# EAGLE design PRoMo_Base_CMS (EAGLE 7.2.0)
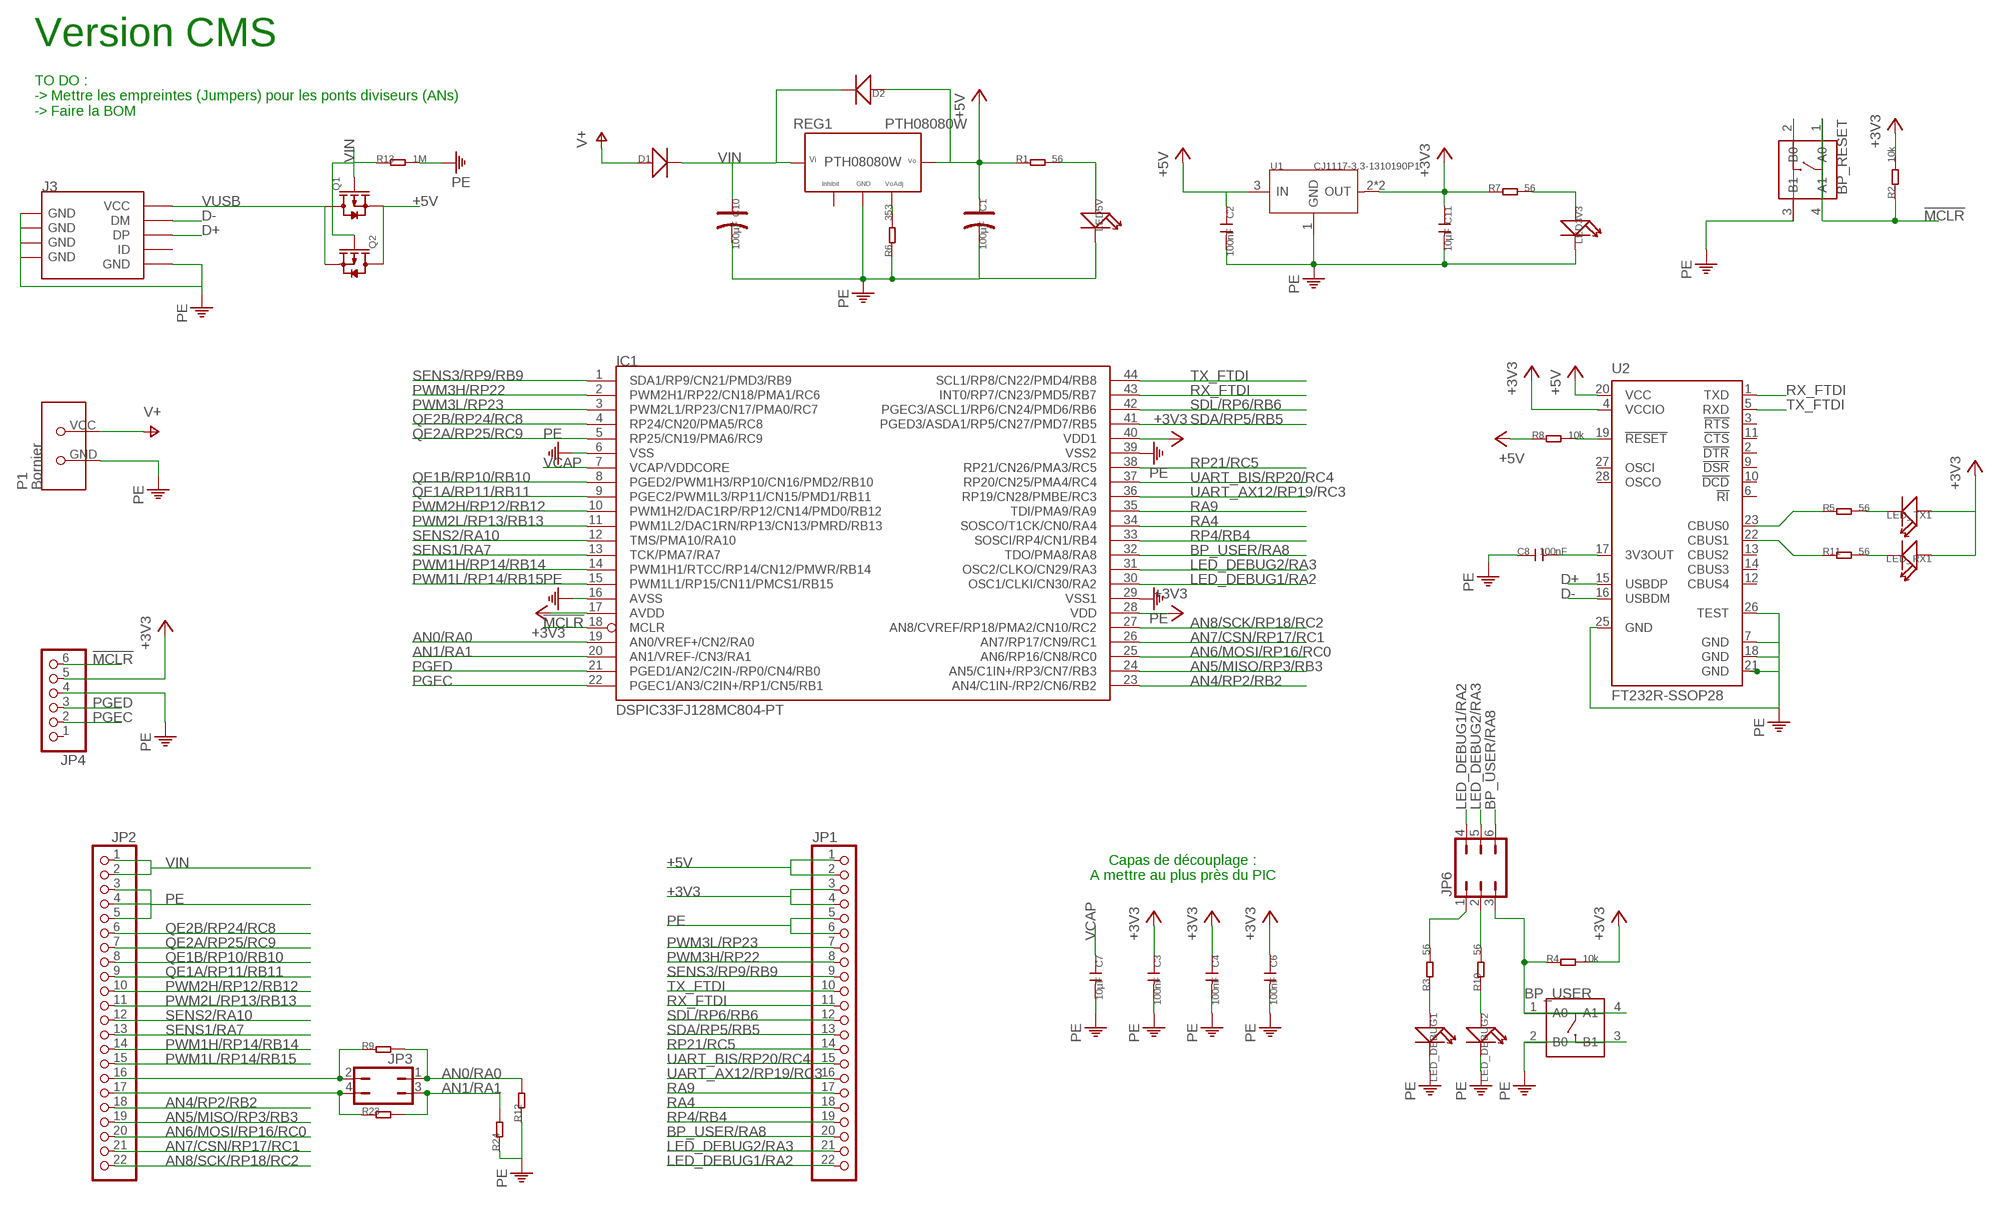
[diagram p0: schematic, sheet 1]

## Parts
BP_RESET  BUTTON-4P-6.2X6.2  [4P-6.2X6.2]
BP_USER  BUTTON-4P-6.2X6.2  [4P-6.2X6.2]
C1  100µF  CAP-D5.3/2.0  [ELECTRO-5.3MM]
C2  100nF  C-0805  [C0805]
C3  100nF  C-0805  [C0805]
C4  100nF  C-0805  [C0805]
C6  100nF  C-0805  [C0805]
C7  10µF  C-0805  [C0805]
C8  100nF  C-0805  [C0805]
C10  100µF  CAP-D5.3/2.0  [ELECTRO-5.3MM]
C11  10µF  C-0805  [C0805]
D1  D'1206'  [SOD123]
D2  D'1206'  [SOD123]
IC1  DSPIC33FJ128MC804-PT  [TQFP44]
J3  USB-MINIUSB-5P-TH  [MINI-5P]
JP1  PINHD-1X22  [1X22]
JP2  PINHD-1X22  [1X22]
JP3  JP2Q  [JP2Q]
JP4  PINHD-1X6/90  [1X06/90]
JP6  JP3Q  [JP3Q]
LED3V3  LED'1206'  [LED-1206]
LED5V  LED'1206'  [LED-1206]
LED_DEBUG1  LED'1206'  [LED-1206]
LED_DEBUG2  LED'1206'  [LED-1206]
LED_RX1  LED'1206'  [LED-1206]
LED_TX1  LED'1206'  [LED-1206]
P1  Bornier  BORNIER_3.5MM  [BORNIER_COUDEE_3.5]
Q1  MOSFET-P'SI2323CDS/SI2305DS<BR>'  [SOT23]
Q2  MOSFET-P'SI2323CDS/SI2305DS<BR>'  [SOT23]
R1  56  R-0805  [R0805]
R2  10k  R-0805  [R0805]
R3  56  R-0805  [R0805]
R4  10k  R-0805  [R0805]
R5  56  R-0805  [R0805]
R6  353  R-0204/7  [R0204/7]
R7  56  R-0805  [R0805]
R8  10k  R-0805  [R0805]
R9  R-0805  [R0805]
R10  56  R-0805  [R0805]
R11  56  R-0805  [R0805]
R12  R-0805  [R0805]
R13  1M  R-0805  [R0805]
R23  R-0805  [R0805]
R24  R-0805  [R0805]
REG1  PTH08080W  [PTH08080W]
U1  CJ1117-3.3-1310190P1  [SOT223]
U2  FT232R-SSOP28  [SSOP28]

## Nets
!MCLR!: BP_RESET.1(A0) BP_RESET.4(A1) IC1.18(MCLR) JP4.6 R2.1
+3V3: C3.1 C4.1 C6.1 C11.1 IC1.17(AVDD) IC1.28(VDD) IC1.40(VDD1) JP1.3 JP1.4 JP4.5 LED_RX1.+ LED_TX1.+ R2.2 R4.2 R7.1 U1.2(OUT) U1.TER(OUT) U2.4(VCCIO)
+5V: C1.+ C2.1 D2.+ JP1.1 JP1.2 Q1.2(S) Q2.3(D) R1.1 R8.1 REG1.P$3(3_VO) U1.3(IN) U2.20(VCC)
AN0/RA0: IC1.19(AN0/VREF+/CN2/RA0) JP3.1 R9.2 R12.2
AN1/RA1: IC1.20(AN1/VREF-/CN3/RA1) JP3.3 R23.2 R24.2
AN4/RP2/RB2: IC1.23(AN4/C1IN-/RP2/CN6/RB2) JP2.18
AN5/MISO/RP3/RB3: IC1.24(AN5/C1IN+/RP3/CN7/RB3) JP2.19
AN6/MOSI/RP16/RC0: IC1.25(AN6/RP16/CN8/RC0) JP2.20
AN7/CSN/RP17/RC1: IC1.26(AN7/RP17/CN9/RC1) JP2.21
AN8/SCK/RP18/RC2: IC1.27(AN8/CVREF/RP18/PMA2/CN10/RC2) JP2.22
BP: BP_USER.1(A0) BP_USER.4(A1) JP6.3 R4.1
BP_USER/RA8: IC1.32(TDO/PMA8/RA8) JP1.20 JP6.6
D+: J3.DP U2.15(USBDP)
D-: J3.DM U2.16(USBDM)
LED_DEBUG1/RA2: IC1.30(OSC1/CLKI/CN30/RA2) JP1.22 JP6.4
LED_DEBUG2/RA3: IC1.31(OSC2/CLKO/CN29/RA3) JP1.21 JP6.5
N$2: R6.2 REG1.P$4(4_VOADJ)
N$3: LED5V.+ R1.2
N$5: LED_DEBUG1.+ R3.1
N$6: JP6.1 R3.2
N$7: LED3V3.+ R7.2
N$8: C8.2 U2.17(3V3OUT)
N$9: R8.2 U2.19(!RESET)
N$10: JP2.17 JP3.4 R23.1
N$11: JP2.16 JP3.2 R9.1
N$12: R11.1 U2.22(CBUS1)
N$13: R5.1 U2.23(CBUS0)
N$14: LED_DEBUG2.+ R10.1
N$15: LED_TX1.- R5.2
N$16: JP6.2 R10.2
N$17: LED_RX1.- R11.2
PE: BP_RESET.2(B0) BP_RESET.3(B1) BP_USER.2(B0) BP_USER.3(B1) C1.- C2.2 C3.2 C4.2 C6.2 C7.2 C8.1 C10.- C11.2 IC1.6(VSS) IC1.16(AVSS) IC1.29(VSS1) IC1.39(VSS2) J3.GND J3.S1(GND) J3.S2(GND) J3.S3(GND) J3.S4(GND) JP1.5 JP1.6 JP2.3 JP2.4 JP2.5 JP4.4 LED3V3.- LED5V.- LED_DEBUG1.- LED_DEBUG2.- P1.GND R6.1 R12.1 R13.2 R24.1 REG1.P$2(2_GND) U1.1(GND) U2.7(GND) U2.18(GND) U2.21(GND) U2.25(GND) U2.26(TEST)
PGEC: IC1.22(PGEC1/AN3/C2IN+/RP1/CN5/RB1) JP4.2
PGED: IC1.21(PGED1/AN2/C2IN-/RP0/CN4/RB0) JP4.3
PWM1H/RP14/RB14: IC1.14(PWM1H1/RTCC/RP14/CN12/PMWR/RB14) JP2.14
PWM1L/RP14/RB15: IC1.15(PWM1L1/RP15/CN11/PMCS1/RB15) JP2.15
PWM2H/RP12/RB12: IC1.10(PWM1H2/DAC1RP/RP12/CN14/PMD0/RB12) JP2.10
PWM2L/RP13/RB13: IC1.11(PWM1L2/DAC1RN/RP13/CN13/PMRD/RB13) JP2.11
PWM3H/RP22: IC1.2(PWM2H1/RP22/CN18/PMA1/RC6) JP1.8
PWM3L/RP23: IC1.3(PWM2L1/RP23/CN17/PMA0/RC7) JP1.7
QE1A/RP11/RB11: IC1.9(PGEC2/PWM1L3/RP11/CN15/PMD1/RB11) JP2.9
QE1B/RP10/RB10: IC1.8(PGED2/PWM1H3/RP10/CN16/PMD2/RB10) JP2.8
QE2A/RP25/RC9: IC1.5(RP25/CN19/PMA6/RC9) JP2.7
QE2B/RP24/RC8: IC1.4(RP24/CN20/PMA5/RC8) JP2.6
RA4: IC1.34(SOSCO/T1CK/CN0/RA4) JP1.18
RA9: IC1.35(TDI/PMA9/RA9) JP1.17
RP4/RB4: IC1.33(SOSCI/RP4/CN1/RB4) JP1.19
RP21/RC5: IC1.38(RP21/CN26/PMA3/RC5) JP1.14
RX_FTDI: IC1.43(INT0/RP7/CN23/PMD5/RB7) JP1.11 U2.1(TXD)
SDA/RP5/RB5: IC1.41(PGED3/ASDA1/RP5/CN27/PMD7/RB5) JP1.13
SDL/RP6/RB6: IC1.42(PGEC3/ASCL1/RP6/CN24/PMD6/RB6) JP1.12
SENS1/RA7: IC1.13(TCK/PMA7/RA7) JP2.13
SENS2/RA10: IC1.12(TMS/PMA10/RA10) JP2.12
SENS3/RP9/RB9: IC1.1(SDA1/RP9/CN21/PMD3/RB9) JP1.9
TX_FTDI: IC1.44(SCL1/RP8/CN22/PMD4/RB8) JP1.10 U2.5(RXD)
UART_AX12/RP19/RC3: IC1.36(RP19/CN28/PMBE/RC3) JP1.16
UART_BIS/RP20/RC4: IC1.37(RP20/CN25/PMA4/RC4) JP1.15
V+: D1.+ P1.VCC
VCAP: C7.1 IC1.7(VCAP/VDDCORE)
VIN: C10.+ D1.- D2.- JP2.1 JP2.2 Q1.1(G) Q2.1(G) R13.1 REG1.P$1(1_VI)
VUSB: J3.VCC Q1.3(D) Q2.2(S)
Unconnected: J3.ID JP4.1 REG1.P$5(5_INHIBIT) U2.2(!DTR) U2.3(!RTS) U2.6(!RI) U2.9(!DSR) U2.10(!DCD) U2.11(!CTS) U2.12(CBUS4) U2.13(CBUS2) U2.14(CBUS3) U2.27(OSCI) U2.28(OSCO)

## Notes on the sheet
- Version CMS
- TO DO : 
  -> Mettre les empreintes (Jumpers) pour les ponts diviseurs (ANs)
  -> Faire la BOM
- Capas de découplage :
  A mettre au plus près du PIC

## Library data of the parts
BP_RESET BP_USER = Discrete:BUTTON-4P
C1 C10 = Discrete:CAP*: Electrolytic Capacitors,Tantalum Capacitors and Super Capacitors
C2-C4 C6-C8 C11 = Discrete:C*: Ceramic Capacitors
D1 D2 = Discrete:D*
IC1 = microchip-dspic33fjxxmc:DSPIC33FJ128MC804: dsPIC33FJ32MC302/304, dsPIC33FJ64MCX02/X04, AND dsPIC33FJ128MCX02/X04 High-Performance, 16-bit Digital Signal Controllers Package:44 Pin TQFP Operating Range: * Up to 40 MIPS operation (at 3.0V -3.6V): - Industrial temperature range (-40°C to +85°C) - Extended temperature range (-40°C to +125°C) High-Performance DSC CPU: * Modified Harvard architecture * C compiler optimized instruction set * 16-bit wide data path * 24-bit wide instructions * Linear program memory addressing up to 4M instruction words * Linear data memory addressing up to 64 Kbytes * 83 base instructions: mostly 1 word/1 cycle * Two 40-bit accumulators with rounding and saturation options * Flexible and powerful addressing modes: - Indirect - Modulo - Bit-Reversed * Software stack * 16 x 16 fractional/integer multiply operations * 32/16 and 16/16 divide operations * Single-cycle multiply and accumulate: - Accumulator write back for DSP operations - Dual data fetch * Up to ±16-bit shifts for up to 40-bit data Direct Memory Access (DMA): * 8-channel hardware DMA * Up to 2 Kbytes dual ported DMA buffer area (DMA RAM) to store data transferred via DMA: - Allows data transfer between RAM and a peripheral while CPU is executing code (no cycle stealing) * Most peripherals support DMA Timers/Capture/Compare/PWM: * Timer/Counters, up to five 16-bit timers: - Can pair up to make two 32-bit timers - One timer runs as a Real-Time Clock with an external 32.768 kHz oscillator - Programmable prescaler * Input Capture (up to four channels): - Capture on up, down or both edges - 16-bit capture input functions - 4-deep FIFO on each capture * Output Compare (up to four channels): - Single or Dual 16-bit Compare mode - 16-bit Glitchless PWM mode * Hardware Real-Time Clock/Calendar (RTCC): - Provides clock, calendar, and alarm functions Interrupt Controller: * 5-cycle latency * Up to 53 available interrupt sources * Up to three external interrupts * Seven programmable priority levels * Five processor exceptions Digital I/O: * Peripheral pin Select functionality * Up to 35 programmable digital I/O pins * Wake-up/Interrupt-on-Change for up to 31 pins * Output pins can drive from 3.0V to 3.6V * Up to 5V output with open drain configuration * All digital input pins are 5V tolerant * 4 mA sink on all I/O pins On-Chip Flash and SRAM: * Flash program memory (up to 128 Kbytes) * Data SRAM (up to 16 Kbytes) * Boot, Secure, and General Security for program Flash System Management: * Flexible clock options: - External, crystal, resonator, internal RC - Fully integrated Phase-Locked Loop (PLL) - Extremely low jitter PLL * Power-up Timer * Oscillator Start-up Timer/Stabilizer * Watchdog Timer with its own RC oscillator * Fail-Safe Clock Monitor * Reset by multiple sources Power Management: * On-chip 2.5V voltage regulator * Switch between clock sources in real time * Idle, Sleep, and Doze modes with fast wake-up Analog-to-Digital Converters (ADCs): * 10-bit, 1.1 Msps or 12-bit, 500 Ksps conversion: - Two and four simultaneous samples (10-bit ADC) - Up to nine input channels with auto-scanning - Conversion start can be manual or synchronized with one of four trigger sources - Conversion possible in Sleep mode - ±2 LSb max integral nonlinearity - ±1 LSb max differential nonlinearity Audio Digital-to-Analog Converter (DAC): - 16-bit Dual Channel DAC module - 100 Ksps maximum sampling rate - Second-Order Digital Delta-Sigma Modulator Comparator Module: * Two analog comparators with programmable input/output configuration CMOS Flash Technology: * Low-power, high-speed Flash technology * Fully static design * 3.3V (±10%) operating voltage * Industrial and Extended temperature * Low power consumption Motor Control Peripherals: * 6-channel 16-bit Motor Control PWM: - Three duty cycle generators - Independent or Complementary mode - Programmable dead-time and output polarity - Edge-aligned or center-aligned - Manual output override control - One Fault input - Trigger for ADC conversions - PWM frequency for 16-bit resolution (@ 40 MIPS) = 1220 Hz for Edge-Aligned mode, 610 Hz for Center-Aligned mode - PWM frequency for 11-bit resolution (@ 40 MIPS) = 39.1 kHz for Edge-Aligned mode, 19.55 kHz for Center-Aligned mode * 2-channel 16-bit Motor Control PWM: - One duty cycle generator - Independent or Complementary mode - Programmable dead time and output polarity - Edge-aligned or center-aligned - Manual output override control - One Fault input - Trigger for ADC conversions - PWM frequency for 16-bit resolution (@ 40 MIPS) = 1220 Hz for Edge-Aligned mode, 610 Hz for Center-Aligned mode - PWM frequency for 11-bit resolution (@ 40 MIPS) = 39.1 kHz for Edge-Aligned mode, 19.55 kHz for Center-Aligned mode * 2-Quadrature Encoder Interface module: - Phase A, Phase B, and index pulse input - 16-bit up/down position counter - Count direction status - Position Measurement (x2 and x4) mode - Programmable digital noise filters on inputs - Alternate 16-bit Timer/Counter mode - Interrupt on position counter rollover/underflow
J3 = Connector :USB-MINIUSB-5P
JP1 JP2 = pinhead:PINHD-1X22: PIN HEADER
JP3 = jumper:JP2Q: JUMPER
JP4 = pinhead:PINHD-1X6: PIN HEADER
JP6 = jumper:JP3Q: JUMPER
LED3V3 LED5V LED_DEBUG1 LED_DEBUG2 LED_RX1 LED_TX1 = Discrete:LED*
P1 = Perso:BORNIER_3.5MM: Bornier 3.5mm Bornier emfichable 3.5mm coudée
Q1 Q2 = Discrete:MOSFET-P
R1-R13 R23 R24 = Discrete:R*
REG1 = Perso:PTH08080W: TI Régulateur PTH08080W : Vin = [4.5 ; 18] V, Vout = [0.9 ; 5.5] V, Iout = 2.25 A.
U1 = OPL:CJ1117-3.3: 1A Low Dropout Linear Regulator
U2 = IC:FT232R: USB UART IC Source: http://www.ftdichip.com/Documents/DataSheets/DS_FT232R_v104.pdf

## Board
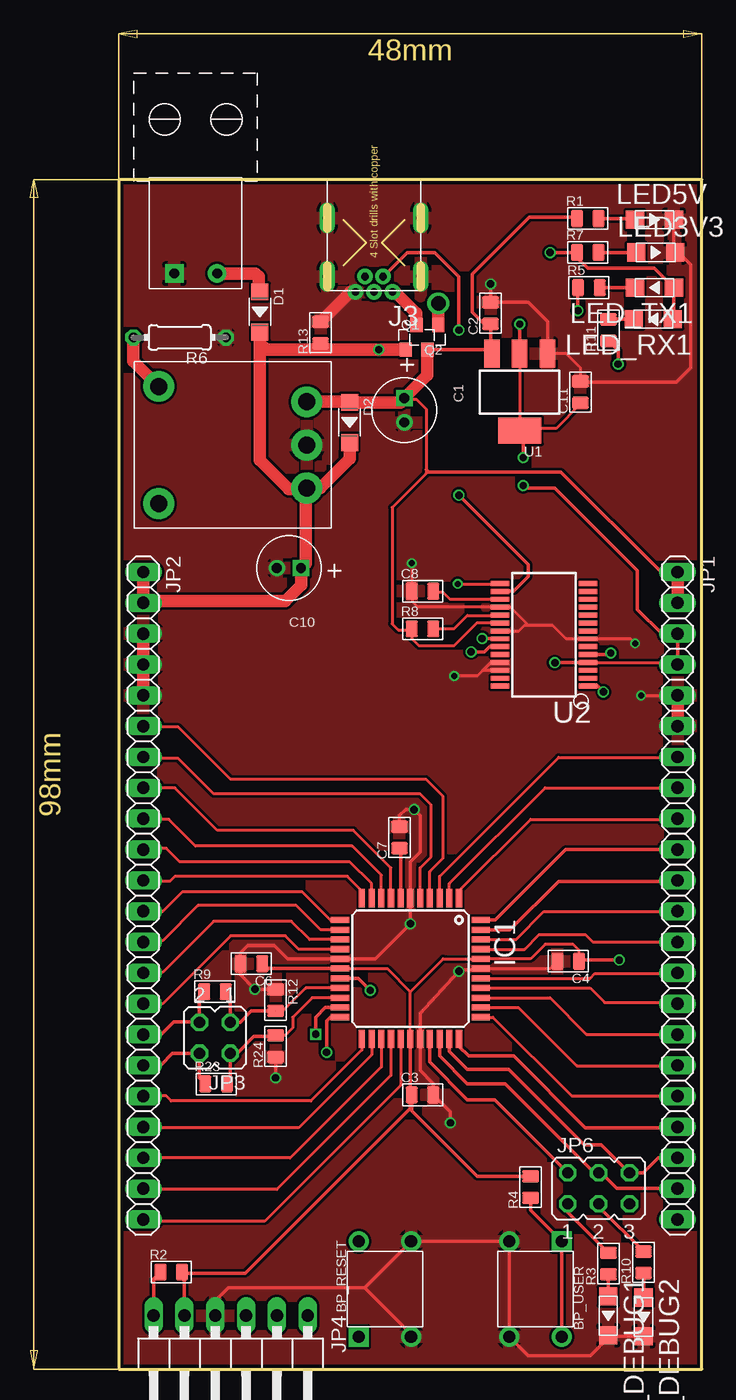
[diagram p1: board, top side]
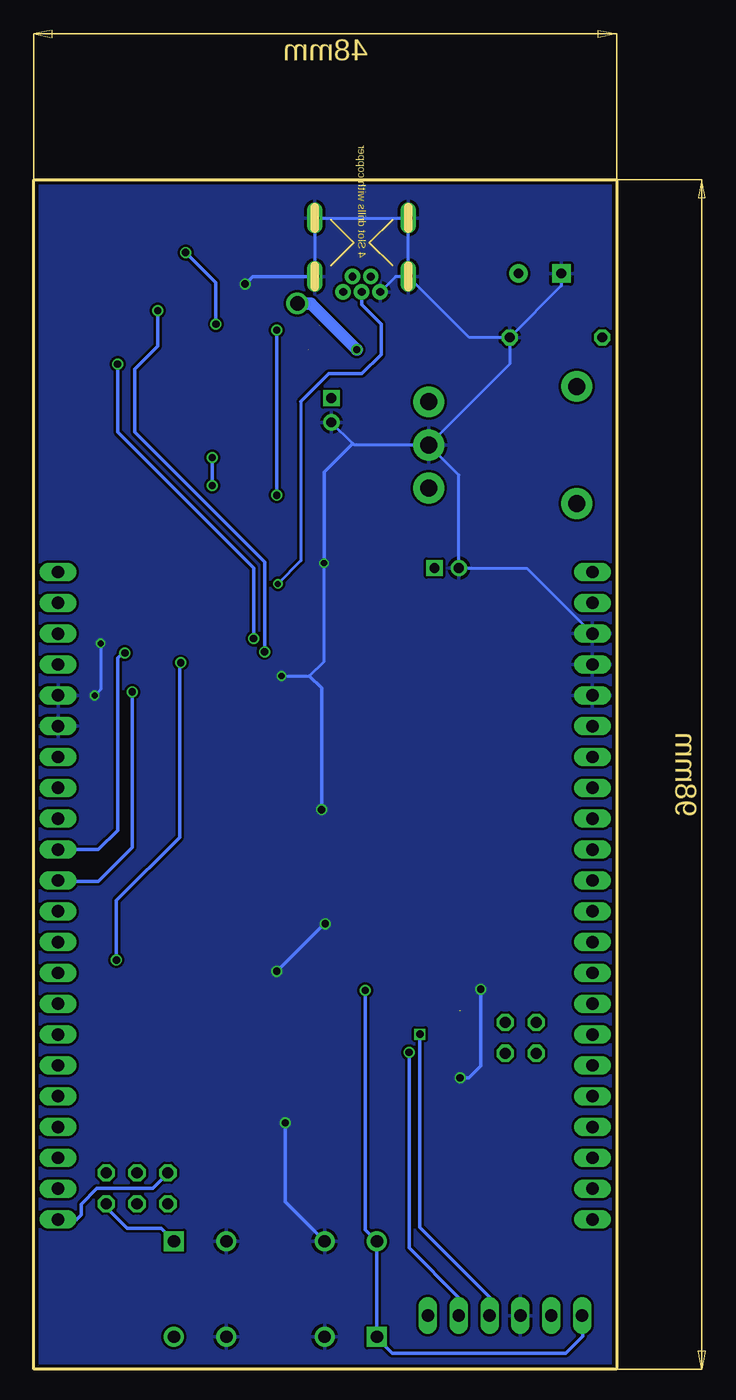
[diagram p2: board, bottom side, seen from below]

Size 48 x 98 mm. Coordinates in mm from the lower left corner, seen from the top.
Outline: 0,0 48,0 48,98 0,98 0,0
Copper layers (1*16): Top 0.035mm / dielectric 1.5mm / Bottom 0.035mm
Design rules "SeeedStudio_2layer_DRU_no_angle_20140221 *": minimum track width 6mil, minimum drill 12mil, track to track 8mil, track to pad 8mil, pad to pad 8mil, via to via 8mil, smd to smd 0mil, copper to edge 10mil, drill to drill 10mil, minimum pad ring 10mil, minimum via ring 6mil, stop-mask expansion 2mil, vias tented up to drill 100mil, thermal gap 10mil

### Footprints (pad centres in the part's own frame; a part is rotated, then mirrored left to right if it is on the bottom)
4P-6.2X6.2 = drill 1.016 pad 1.651 square: 1 -3.937,2.159 | drill 1.016 pad 1.651: 2 -3.937,-2.159; 3 3.937,-2.159; 4 3.937,2.159
ELECTRO-5.3MM = drill 0.8 pad 1.35 square: + -1,0 | drill 0.8 pad 1.35: - 1,0
C0805 = smd 1.016 x 1.397: 1 -0.889,0; 2 0.889,0
SOD123 = smd 1.397 x 1.397: + -1.651,0; - 1.651,0
TQFP44 = smd 1.5 x 0.5: 1 -5.8,4; 2 -5.8,3.2; 3 -5.8,2.4; 4 -5.8,1.6; 5 -5.8,0.8; 6 -5.8,0; 7 -5.8,-0.8; 8 -5.8,-1.6; 9 -5.8,-2.4; 10 -5.8,-3.2; 11 -5.8,-4; 23 5.8,-4; 24 5.8,-3.2; 25 5.8,-2.4; 26 5.8,-1.6; 27 5.8,-0.8; 28 5.8,0; 29 5.8,0.8; 30 5.8,1.6; 31 5.8,2.4; 32 5.8,3.2; 33 5.8,4 | smd 0.5 x 1.5: 12 -4,-5.8; 13 -3.2,-5.8; 14 -2.4,-5.8; 15 -1.6,-5.8; 16 -0.8,-5.8; 17 0,-5.8; 18 0.8,-5.8; 19 1.6,-5.8; 20 2.4,-5.8; 21 3.2,-5.8; 22 4,-5.8; 34 4,5.8; 35 3.2,5.8; 36 2.4,5.8; 37 1.6,5.8; 38 0.8,5.8; 39 0,5.8; 40 -0.8,5.8; 41 -1.6,5.8; 42 -2.4,5.8; 43 -3.2,5.8; 44 -4,5.8
MINI-5P = drill 0.635 pad 1.27: DM -1.016,0.75; DP 0.254,0; GND 0.254,-1.524; ID -1.016,-0.75; VCC 0.254,1.524 | drill 0.7 pad 1.27 long: S1 -5.842,3.85; S2 -1.016,3.85; S3 -5.842,-3.85; S4 -1.016,-3.85
1X22 = drill 1.016 long: 1 -26.67,0; 2 -24.13,0; 3 -21.59,0; 4 -19.05,0; 5 -16.51,0; 6 -13.97,0; 7 -11.43,0; 8 -8.89,0; 9 -6.35,0; 10 -3.81,0; 11 -1.27,0; 12 1.27,0; 13 3.81,0; 14 6.35,0; 15 8.89,0; 16 11.43,0; 17 13.97,0; 18 16.51,0; 19 19.05,0; 20 21.59,0; 21 24.13,0; 22 26.67,0
JP2Q = drill 0.914 octagon: 1 -1.27,-1.27; 2 1.27,-1.27; 3 -1.27,1.27; 4 1.27,1.27
1X06/90 = drill 1.016 long: 1 -6.35,-3.81; 2 -3.81,-3.81; 3 -1.27,-3.81; 4 1.27,-3.81; 5 3.81,-3.81; 6 6.35,-3.81
JP3Q = drill 0.914 octagon: 1 -2.54,-1.27; 2 0,-1.27; 3 2.54,-1.27; 4 -2.54,1.27; 5 0,1.27; 6 2.54,1.27
LED-1206 = smd 1.5 x 1.5: + -1.6,0; - 1.6,0
BORNIER_COUDEE_3.5 = drill 0.8 pad 1.524 square: GND 2.057,1.27 | drill 0.8 pad 1.524: VCC 5.588,1.27
SOT23 = smd 1.016 x 1.143: 1 -0.889,-1.016; 2 0.889,-1.016; 3 0,1.016
R0805 = smd 1.016 x 1.397: 1 -0.889,0; 2 0.889,0
R0204/7 = drill 0.813 octagon: 1 -3.81,0; 2 3.81,0
PTH08080W = drill 1.4 pad 2.54: P$1 2.032,10.414; P$2 2.032,6.858; P$3 2.032,3.302; P$4 14.224,2.032; P$5 14.224,11.684
SOT223 = smd 1.27 x 2.286: 1 -2.286,-3.175; 2 0,-3.175; 3 2.286,-3.175 | smd 3.556 x 2.159: TER 0,3.175
SSOP28 = smd 0.4 x 1.5: 1 -4.225,-3.625; 2 -3.575,-3.625; 3 -2.925,-3.625; 4 -2.275,-3.625; 5 -1.625,-3.625; 6 -0.975,-3.625; 7 -0.325,-3.625; 8 0.325,-3.625; 9 0.975,-3.625; 10 1.625,-3.625; 11 2.275,-3.625; 12 2.925,-3.625; 13 3.575,-3.625; 14 4.225,-3.625; 15 4.225,3.625; 16 3.575,3.625; 17 2.925,3.625; 18 2.275,3.625; 19 1.625,3.625; 20 0.975,3.625; 21 0.325,3.625; 22 -0.325,3.625; 23 -0.975,3.625; 24 -1.625,3.625; 25 -2.275,3.625; 26 -2.925,3.625; 27 -3.575,3.625; 28 -4.225,3.625

### Placement (x,y rotation side)
BP_RESET  21.9,6.6 90 top
BP_USER  34.3,6.6 270 top
C1  23.5,79 270 top
C2  30.6,87 90 top
C3  25,22.6 0 top
C4  37,33.6 180 top
C6  10.9,33.4 180 top
C7  23.1,43.8 90 top
C8  25,64.1 0 top
C10  14,66 180 top
C11  38,80.5 90 top
D1  11.6,87.1 270 top
D2  19,78 270 top
IC1  24,33 270 top
J3  21,89 270 top
JP1  46,39 270 top
JP2  2,39 270 top
JP3  7.9,27.3 180 top
JP4  9.2,0.6 180 top
JP6  39.5,14.9 0 top
LED3V3  44.2,92 0 top
LED5V  44.1,94.7 0 top
LED_DEBUG1  40.3,4.4 270 top
LED_DEBUG2  43.2,4.3 270 top
LED_RX1  44,86.5 180 top
LED_TX1  44.1,89.1 180 top
P1  2.5,89 0 top
Q1  24.5,85 0 top
Q2  25.4,85 180 top
R1  38.6,94.8 0 top
R2  4.3,8 0 top
R3  40.3,8.7 90 top
R4  33.9,15 90 top
R5  38.7,89.1 0 top
R6  5,85 180 top
R7  38.6,92 0 top
R8  25,61 0 top
R9  7.9,31.1 0 top
R10  43.2,8.8 90 top
R11  40.3,85.6 90 top
R12  12.9,30.4 270 top
R13  16.6,85.4 90 top
R23  8,23.5 0 top
R24  12.9,26.6 90 top
REG1  17.5,83 180 top
U1  33,80.5 180 top
U2  35,60.5 90 top

### Tracks (layer width: path | path; a pad name or v marks a point on that pad's centre or on a via)
!MCLR!  (via drill 0.6)
  Top 0.305: JP4.6 2.85,7.44 R2.1 | IC1.18 19.7,32.2 v20.7,31.2
  Bottom 0.305: v20.7,31.2 20.7,11.5 BP_RESET.4 BP_RESET.1 19.74,2.54 18.5,1.3 4.2,1.3 2.8,2.7 2.8,4.36 JP4.6
+3V3  (via drill 0.6)
  Top 0.254: C11.1 38,79.5 36,77.5 33.5,77.5 | 33.5,77.5 33.17,77.5 U1.TER | U1.2 33,78 33.5,77.5 | IC1.28 24,31.1 | 24,31.1 26.7,33.8 IC1.40 33.9,33.8 35.1,35 37.4,35 37.89,34.51 C4.1 | IC1.17 22.1,33 24,31.1 | U2.4 45.83,58.23
  Top 0.305: U1.2 v33,86.1 | v35.5,92 R7.1 37.71,91.59 38.6,90.7 44.1,90.7 LED_TX1.+ 45.7,86.6 LED_RX1.+ | IC1.28 24,22.71 | 24,22.71 C3.1 24.11,21.29 29.5,15.9 R4.2 | JP4.5 5.39,7.8 R2.2 5.29,7.9 10.4,7.9 24,21.5 24,22.71 | v33.3,72.8 33.5,72.6 35.9,72.6 42.7,65.8 42.7,62.6 44.71,60.59 JP1.3 JP1.4 45.83,58.23 | v33.3,75.1 33.3,77.03 U1.TER | U2.4 35.92,58.23 v35.9,58.2 | v41.2,33.7 37.99,33.7 C4.1 | C6.1 11.9,33.4 12.3,33 IC1.17
  Bottom 0.305: v33,86.1 33,89.5 v35.5,92 | v33.3,72.8 v33.3,75.1 | v41.2,33.7 41.2,38.6 36,43.8 36,58.1 v35.9,58.2
+5V  (1 unrouted)
  Top 0.254: U2.20 31.35,61.5 29.5,61.5 27.6,59.6 24.7,59.6 24.11,60.19 R8.1 24.01,60.9 23,60.9 22.5,61.4 22.5,71 25.3,73.8 25.3,74.1 25.3,79.1 24.5,79.9 23.6,79.9 23.35,79.65 23.15,79.65
  Top 0.305: Q2.3 30.41,83.98 U1.3 30.6,83.79 C2.1 30.09,86.11 29.1,87.1 29.1,90.2 33.8,94.9 37.61,94.9 R1.1 | JP1.2 46,65.6 45.9,65.7 44.6,65.7 36.4,73.9 25.5,73.9 25.3,74.1
  Top 1.016: REG1.P$3 18.95,79.7 D2.+ 23.15,79.65 C1.+ 25.39,81.89 Q1.2 | JP1.1 JP1.2
AN0/RA0  (1 unrouted)
  Top 0.254: IC1.19 15.4,31.4 13.5,29.5 R12.2
  Top 0.305: R9.2 9.17,30.72 JP3.1 9.97,28.57 10.9,29.5 12.89,29.5 R12.2
AN1/RA1
  Top 0.254: IC1.20 15.9,30.6 14.3,29 14.3,28.1 13.7,27.5 R24.2
  Top 0.305: R23.2 9.17,23.78 JP3.3 9.73,26.03 11.1,27.4 12.81,27.4 R24.2
AN4/RP2/RB2
  Top 0.254: IC1.23 20,26.3 15.8,22.1 4.3,22.1 3.9,22.5 JP2.18
AN5/MISO/RP3/RB3
  Top 0.254: IC1.24 20.8,25.9 14.8,19.9 2.05,19.9 JP2.19
AN6/MOSI/RP16/RC0
  Top 0.254: IC1.25 21.6,24.9 14.1,17.4 JP2.20
AN7/CSN/RP17/RC1
  Top 0.254: IC1.26 22.4,24.2 13,14.8 2.07,14.8 JP2.21
AN8/SCK/RP18/RC2
  Top 0.254: IC1.27 23.2,23.4 12,12.2 2.13,12.2 JP2.22
BP
  Top 0.305: R4.1 33.9,13.1 BP_USER.1 BP_USER.4
  Bottom 0.305: JP6.3 42.04,13.34 40.3,11.6 37.52,11.6 BP_USER.1
BP_USER/RA8
  Top 0.305: IC1.32 27.2,26.2 28.7,24.7 32.1,24.7 38.3,18.5 39.71,18.5 JP6.6 43.17,16.17 44.4,17.4 JP1.20
D+  (via drill 0.5)
  Top 0.254: v27.9,64.7 31.35,64.7 U2.15
  Bottom 0.254: 26,79.7 26,66.6 v27.9,64.7
  Bottom 0.305: 26,79.7 23.7,82 21,82 19.4,83.6 19.4,86.1 21,87.7 J3.DP
D-  (via drill 0.6)
  Top 0.305: J3.DM 23.73,92 26,92 28,90 v28,85.6 | U2.16 31.4,64.1 32.5,64.1 33.7,65.3 33.7,66.3 28.3,71.7 v28,72
  Bottom 0.305: v28,85.6 v28,72
LED_DEBUG1/RA2
  Top 0.305: IC1.30 25.6,25.3 28.7,22.2 30.93,22.2 JP6.4
  Bottom 0.305: JP6.4 36.96,16.14 38.2,14.9 42.8,14.9 44.1,13.6 44.1,12.7 44.5,12.3 45.97,12.3 JP1.22
LED_DEBUG2/RA3
  Top 0.305: IC1.31 26.4,25.8 28.7,23.5 31.8,23.5 39.13,16.17 JP6.5 39.73,16.17 41,14.9 45.97,14.9 JP1.21
N$2
  Top 1.016: R6.2 1.19,83.05 REG1.P$4
N$3
  Top 0.305: R1.2 42.4,94.8 LED5V.+
N$5
  Top 0.305: R3.1 LED_DEBUG1.+
N$6
  Top 0.305: JP6.1 36.96,12.93 R3.2
N$7
  Top 0.305: R7.2 LED3V3.+
N$8
  Top 0.254: U2.17 27.27,63.42 26.7,64 25.99,64 C8.2
N$9
  Top 0.254: R8.2 27.6,61 28.7,62.1 31.35,62.1 U2.19
N$10
  Top 0.305: JP2.17 3.43,25.03 4.4,26 6.6,26 JP3.4 6.63,23.98 R23.1
N$11
  Top 0.305: JP2.16 3.47,27.57 4.5,28.6 6.6,28.6 JP3.2 6.63,30.72 R9.1
N$12  (via drill 0.6)
  Top 0.305: U2.22 29.93,60.17 v29.9,60.2 | v41.1,82.8 41.1,83.91 R11.1
  Bottom 0.305: v29.9,60.2 29.9,66 41.1,77.2 v41.1,82.8
N$13  (via drill 0.6)
  Top 0.305: U2.23 30.52,59.52 30.1,59.1 v29,59.1 | v37.8,87.2 37.8,89.09 R5.1
  Bottom 0.305: v29,59.1 29,66.5 39.7,77.2 39.7,82.4 37.8,84.3 v37.8,87.2
N$14
  Top 0.305: R10.1 LED_DEBUG2.+
N$15
  Top 0.305: R5.2 LED_TX1.-
N$16
  Top 0.305: JP6.2 39.5,13.39 R10.2
N$17
  Top 0.305: R11.2 LED_RX1.-
PE  (via drill 0.5, 0.6)
  Top 0.254: C11.2 38,82.5 36.83,83.67 U1.1 | U2.21 32.92,60.83 33.4,61.3 33.7,61.3 | 33.7,61.3 35.7,61.3 36.8,60.2 38.6,60.2 U2.7 42.12,60.17 v42.5,59.8 | v43,55.5 JP1.5 | 33.7,61.3 32.23,62.77 U2.18 24.62,62.77 24.2,63.2 24.2,64.01 C8.1 24.1,64.11 v24.1,66.4 | U2.26 29.98,57.58 29.5,57.1 v27.6,57.1 | IC1.39 35.51,33 C4.2
  Top 0.305: U1.1 35.3,83.69 35.3,86.3 33.71,87.89 C2.2 v30.6,89.4 | LED5V.- 45.7,92.1 LED3V3.- 46.1,92 47.1,91 47.1,82.5 45.9,81.3 38.09,81.3 C11.2 | 27.91,32.69 24.8,29.3 IC1.29 24.8,24.6 25.9,23.5 25.9,22.61 C3.2 27.3,21.19 v27.3,20.3 | 27.91,32.69 28.1,32.9 29.7,32.9 IC1.39 | v28,32.79 v28,32.78 27.91,32.69 | LED_DEBUG2.- 40.4,2.7 LED_DEBUG1.- 40.3,2.6 38.8,1.1 33.7,1.1 BP_USER.3 BP_USER.2 BP_RESET.3 20.22,6.7 | C7.2 23.1,45.6 23.6,46.1 v24.3,46.1 24.8,45.6 24.8,42.6 24,41.8 IC1.6 v24,36.7 21.1,33.8 IC1.16 13.9,33.8 12.8,34.9 10.6,34.9 10,34.3 10,33.41 C6.2 10.01,32.49 v11.2,31.3 11.21,31.29 R12.1 | U2.25 30.73,58.23 30.7,58.2 30.6,58.2 29.98,57.58 | v12.9,24 R24.1 | JP4.4 7.93,5.63 9,6.7 20.22,6.7 | BP_RESET.2 24.06,2.86 20.22,6.7
  Top 1.016: JP2.3 JP2.4 JP2.5 | JP1.5 JP1.6 | J3.GND 19.06,88.75 R13.2
  Bottom 0.254: P1.GND 4.56,89.25 R6.1 | R6.1 8.81,82.8 REG1.P$2 | REG1.P$2 13,73.67 C10.- 7.41,66 JP2.3 | REG1.P$2 21.64,76.14 21.75,76.25 C1.- | R6.1 12.13,85 J3.S4 | J3.S4 J3.S3 J3.S1 J3.S2 | J3.S4 18.21,90.02 J3.GND | v42.5,59.8 42.5,56 v43,55.5 | v27.6,57.1 25.3,57.1 24.1,58.3 v24.1,66.4
  Bottom 0.305: v24.1,66.4 24.1,73.9 21.75,76.25 | J3.S2 29.98,90.02 v30.6,89.4 | v24,36.7 24.08,36.7 v28,32.79 | v24.3,46.1 24.3,56.1 25.3,57.1 | v11.2,31.3 11.2,25 12.2,24 v12.9,24 | BP_RESET.3 27.3,13.78 v27.3,20.3
  pour Top: 0,98.1 47.9,98.1 48,98.1 48,0 0.1,0 0,0 0,98
  pour Bottom: 0,98 48,98 48,0 0,0
PGEC  (via drill 0.6)
  Top 0.305: IC1.22 17.4,29 17.1,28.7 v17.1,26.1
  Bottom 0.305: v17.1,26.1 17.1,10 13,5.9 JP4.2
PGED  (via drill 0.6)
  Top 0.305: IC1.21 17,29.8 16.2,29 v16.2,27.6
  Bottom 0.305: v16.2,27.6 16.2,11.7 10.4,5.9 10.4,4.48 JP4.3
PWM1H/RP14/RB14
  Top 0.254: IC1.14 15.7,35.4 14.2,36.9 7.8,36.9 3.6,32.7 2.05,32.7 JP2.14
PWM1L/RP14/RB15
  Top 0.254: IC1.15 14.8,34.6 13.7,35.7 9.2,35.7 3.6,30.1 JP2.15
PWM2H/RP12/RB12
  Top 0.254: IC1.10 20.8,40 19,41.8 5,41.8 3.9,42.9 2.09,42.9 JP2.10
PWM2L/RP13/RB13
  Top 0.254: IC1.11 20,39.4 18.8,40.6 4.6,40.6 4.2,40.2 2.07,40.2 JP2.11
PWM3H/RP22
  Top 0.254: IC1.2 27.2,40 35.1,47.9 JP1.8
PWM3L/RP23
  Top 0.254: IC1.3 26.4,40.6 36.2,50.4 45.97,50.4 JP1.7
QE1A/RP11/RB11
  Top 0.254: IC1.9 21.6,40.7 19.2,43.1 6.3,43.1 4.1,45.3 2.05,45.3 JP2.9
QE1B/RP10/RB10
  Top 0.254: IC1.8 22.4,41.3 19.3,44.4 8.1,44.4 4.6,47.9 JP2.8
QE2A/RP25/RC9
  Top 0.254: IC1.5 24.8,41.3 25.7,42.2 25.7,46.5 24.8,47.4 7.8,47.4 4.9,50.3 2.13,50.3 JP2.7
QE2B/RP24/RC8
  Top 0.254: IC1.4 25.6,41 26.7,42.1 26.7,47.2 25.3,48.6 9.2,48.6 4.9,52.9 2.07,52.9 JP2.6
RA4
  Top 0.254: IC1.34 30.8,29 37.3,22.5 JP1.18
RA9
  Top 0.254: IC1.35 32.9,29.8 37.7,25 45.97,25 JP1.17
RP4/RB4
  Top 0.305: IC1.33 28,26.6 28.8,25.8 32.5,25.8 38.4,19.9 45.95,19.9 JP1.19
RP21/RC5
  Top 0.254: IC1.38 38.8,32.2 39.2,32.6 45.95,32.6 JP1.14
RX_FTDI  (via drill 0.6)
  Top 0.305: IC1.43 32.2,36.2 36.2,40.2 45.93,40.2 JP1.11 | U2.1 39.42,56.27 v39.9,55.8
  Bottom 0.305: v39.9,55.8 39.9,43 42.7,40.2 45.93,40.2 JP1.11
SDA/RP5/RB5
  Top 0.254: IC1.41 33.4,34.6 34.6,35.8 38.4,35.8 39,35.2 JP1.13
SDL/RP6/RB6
  Top 0.254: IC1.42 32.7,35.4 35,37.7 45.97,37.7 JP1.12
SENS1/RA7
  Top 0.254: IC1.13 16.6,36.2 14.6,38.2 6.5,38.2 3.6,35.3 2.11,35.3 JP2.13
SENS2/RA10
  Top 0.254: IC1.12 17.4,37 15.1,39.3 5.2,39.3 3.6,37.7 2.03,37.7 JP2.12
SENS3/RP9/RB9
  Top 0.254: IC1.1 28,39.4 33.9,45.3 45.95,45.3 JP1.9
TX_FTDI  (via drill 0.6)
  Top 0.305: IC1.44 31,37 36.8,42.8 JP1.10 | U2.5 40.38,58.88 v40.5,59
  Bottom 0.305: v40.5,59 40.7,59 41.1,58.6 41.1,44.4 42.7,42.8 JP1.10
UART_AX12/RP19/RC3
  Top 0.254: IC1.36 35.5,30.6 38.5,27.6 45.97,27.6 JP1.16
UART_BIS/RP20/RC4
  Top 0.254: IC1.37 38.8,31.4 40,30.2 45.91,30.2 JP1.15
V+
  Top 1.016: P1.VCC 11.23,90.27 11.5,90 11.5,88.85 D1.+
VCAP
  Top 0.305: IC1.7 23.2,42.81 C7.1
VIN  (via drill 0.6, 1.2)
  Top 1.016: D1.- 11.6,84.5 | 11.6,84.5 11.6,74.9 14,72.5 15.38,72.5 | 15.38,72.5 REG1.P$1 16.59,72.59 19,75 D2.- | 16.9,83.98 Q1.1 23.59,84 v21.4,84 | 16.9,83.98 12.12,83.98 11.6,84.5 | 15.38,72.5 15.38,66.38 C10.+ 15,64.6 13.7,63.3 2.17,63.3 JP2.2 JP2.1 | R13.1 16.6,84.28 16.9,83.98 | v26.3,87.8 v26.29,87.79 Q2.1
  Bottom 1.016: v21.4,84 25.2,87.8 v26.3,87.8
VUSB  (1 unrouted)
  Top 1.016: J3.VCC 22.75,88.75 24.5,87 Q1.3